# Altium project PCB_SmartHome.PrjPcb
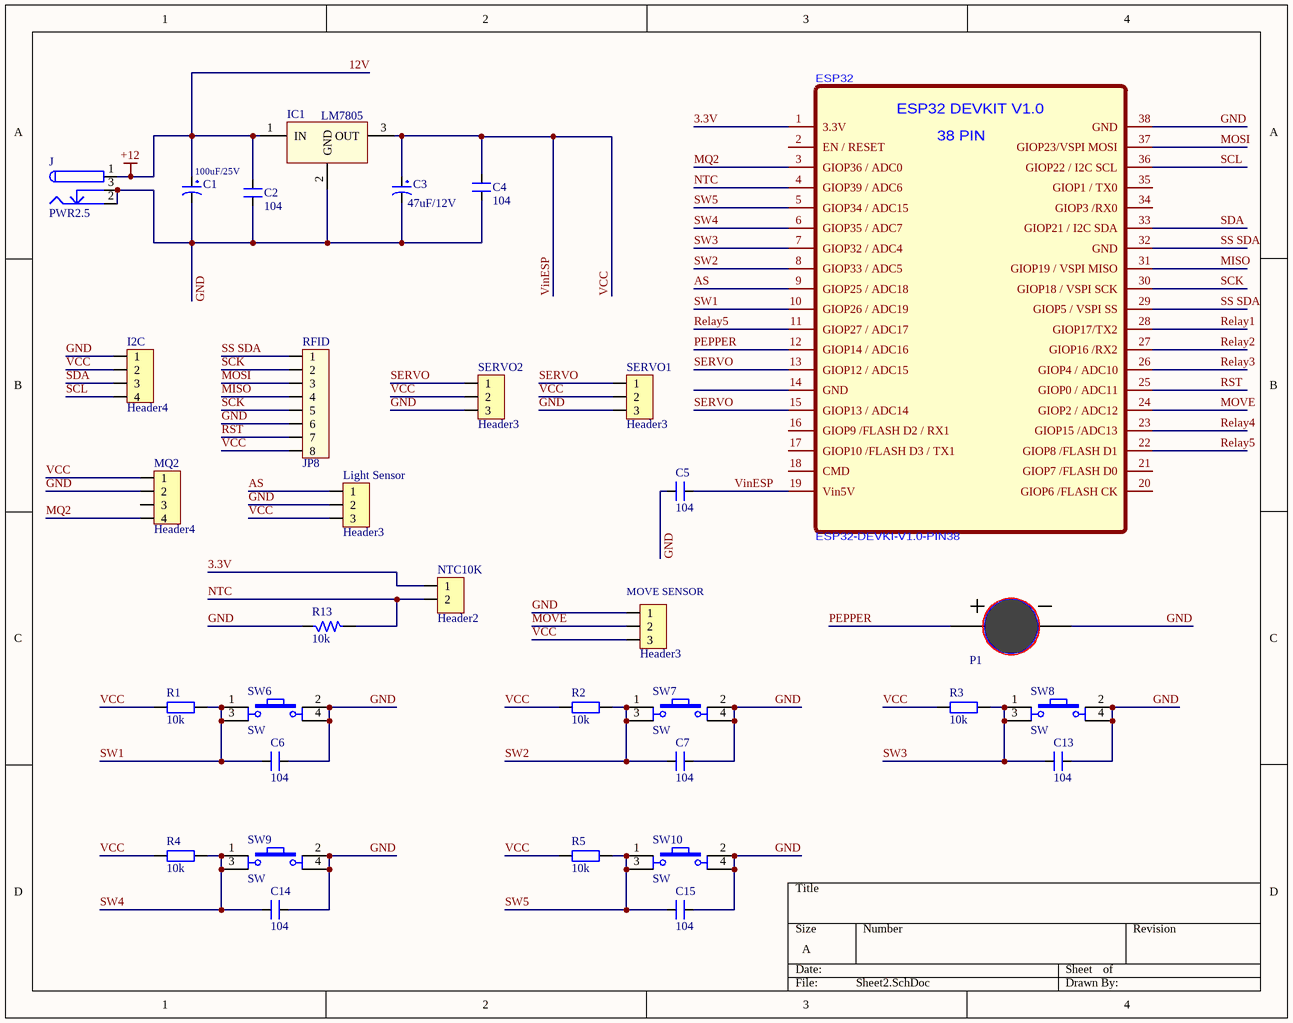
[diagram p0: Sheet2.SchDoc]
2 sheets, 48 parts. Net scope: global (net labels, ports and power ports of the same name join across sheets).
Board file: PCB2.PcbDoc
Sheets:
  Sheet2.SchDoc
  Khoi_Switch.SchDoc

## Sheet Sheet2.SchDoc
size A; SheetNumber: 1; SheetTotal: 2

### Parts
?  P1  [PCBComponent_1]
C1  100uF/25V  [CP1.5/3.4]
C2  104  [CN2]
C3  47uF/12V  [CP1.5/3.4]
C4  104  [CN2]
C5  104  [CN2]
C6  104  [CN2]
C7  104  [CN2]
C13  104  [CN2]
C14  104  [CN2]
C15  104  [CN2]
ESP32  ESP32-DEVKI-V1.0-PIN38  [ESP32-DEVKIT-V1.0-38PIN-PCB - duplicate]
I2C  Header4  [HDR4]
IC1  LM7805  [QTO-220]
J  PWR2.5  [PW-J-2MM]
Light_Sensor  Header3  [HDR3]
MOVE_SENSOR  Header3  [HDR3]
MQ2  Header4  [HDR4]
NTC10K  Header2  [HDR2]
R1  10k  [R1/4W]
R2  10k  [R1/4W]
R3  10k  [R1/4W]
R4  10k  [R1/4W]
R5  10k  [R1/4W]
R13  10k  [R1/8W]
RFID  JP8  [Header8]
SERVO1  Header3  [HDR3]
SERVO2  Header3  [HDR3]
SW6  SW  [SW4]
SW7  SW  [SW4]
SW8  SW  [SW4]
SW9  SW  [SW4]
SW10  SW  [SW4]

### Nets
12V: C1.1 C2.2 IC1.1(IN) J.1  [also labelled +12]
3.3V: ESP32.1(3.3V) NTC10K.1
AS: ESP32.9(GIOP25_/_ADC18) Light_Sensor.1
GND: ?.2 C1.2 C2.1 C3.2 C4.1 C5.1 C6.2 C7.2 C13.2 C14.2 C15.2 ESP32.38(GND) I2C.1 IC1.2(GND) J.2 J.3 Light_Sensor.2 MOVE_SENSOR.1 MQ2.2 R13.1 RFID.6 SERVO1.3 SERVO2.3 SW6.2 SW6.4 SW7.2 SW7.4 SW8.2 SW8.4 SW9.2 SW9.4 SW10.2 SW10.4
MISO: ESP32.31(GIOP19_/_VSPI_MISO) RFID.4
MOSI: ESP32.37(GIOP23/VSPI_MOSI) RFID.3
MOVE: ESP32.24(GIOP2_/_ADC12) MOVE_SENSOR.2
MQ2: ESP32.3(GIOP36_/_ADC0) MQ2.4
NTC: ESP32.4(GIOP39_/_ADC6) NTC10K.2 R13.2
PEPPER: ?.1 ESP32.12(GIOP14_/_ADC16)
Relay1: ESP32.28(GIOP17/TX2)
Relay2: ESP32.27(GIOP16_/RX2)
Relay3: ESP32.26(GIOP4_/_ADC10)
Relay4: ESP32.23(GIOP15_/ADC13)
Relay5: ESP32.11(GIOP27_/_ADC17) ESP32.22(GIOP8_/FLASH_D1)
RST: ESP32.25(GIOP0_/_ADC11) RFID.7
SCK: ESP32.30(GIOP18_/_VSPI_SCK) RFID.2 RFID.5
SCL: ESP32.36(GIOP22_/_I2C_SCL) I2C.4
SDA: ESP32.33(GIOP21_/_I2C_SDA) I2C.3
SERVO: ESP32.13(GIOP12_/_ADC15) ESP32.15(GIOP13_/_ADC14) SERVO1.1 SERVO2.1
SS SDA: ESP32.29(GIOP5_/_VSPI_SS) ESP32.32(GND) RFID.1
SW1: C6.1 ESP32.10(GIOP26_/_ADC19) R1.2 SW6.1 SW6.3
SW2: C7.1 ESP32.8(GIOP33_/_ADC5) R2.2 SW7.1 SW7.3
SW3: C13.1 ESP32.7(GIOP32_/_ADC4) R3.2 SW8.1 SW8.3
SW4: C14.1 ESP32.6(GIOP35_/_ADC7) R4.2 SW9.1 SW9.3
SW5: C15.1 ESP32.5(GIOP34_/_ADC15) R5.2 SW10.1 SW10.3
VCC: C3.1 C4.2 C5.2 ESP32.19(Vin5V) I2C.2 IC1.3(OUT) Light_Sensor.3 MOVE_SENSOR.3 MQ2.1 R1.1 R2.1 R3.1 R4.1 R5.1 RFID.8 SERVO1.2 SERVO2.2  [also labelled VinESP]

Not connected (* = marked no-connect by the designer): ESP32 2(EN_/_RESET) 14(GND) 16(GIOP9_/FLASH_D2_/_RX1) 17(GIOP10_/FLASH_D3_/_TX1) 18(CMD) 20(GIOP6_/FLASH_CK) 21(GIOP7_/FLASH_D0) 34(GIOP3_/RX0) 35(GIOP1_/_TX0); MQ2 3

### Notes on the sheet
- (in symbol ESP32-DEVKI-V1.0-PIN38) ESP32 DEVKIT V1.0; 38 PIN

### Library data of the parts
? = Pepper: Pepper 5V
C1 C3 = CP3: Cap 100uF/35V - 470uF/16V; Value: 100uF/35V/50V; Description 1: 1000uF/6,3V - 470uF/16V - 330uF - 25V; Description 2: 220uF/35V - 100uF/50V - 63V - 4,7uF/200V; Description 3: 22uF => 33uF100V - 3,3uF => 4,7uF/250V; Description 4: 2,2uF =>3,3uF/350 - 2,2uF/400V - 1uF/450V
C2 C4-C7 C13-C15 = CN2: Cap np 104 => 105pF; Value: 0.1uF
I2C MQ2 = Header4: Header IDC, 4 x 1 Pin Vertical 2.54mm Pitch (Non-Boxed, Male); Manufacturer: W¨¹rth Elektronik eiSos GmbH; partNo: 613002143121; ComponentLink1 Description: Manufacturer; ComponentLink2 Description: Datasheet; NoPins: 02; Created Date: 29 March 2013; ComponentLink1URL: http://www.we-online.com; ComponentLink2URL: http://katalog.we-online.de/em/datasheet/6130xx143121.pdf; Created by: Karrer Zheng
IC1 = LM78xx: On ap +, from + 5 to + 24VDC; Value: LM7805
J = PWR2.5: Low Voltage Power Supply Connector; Published: 17-Dec-2003; DatasheetDocument: 09-May-2002; Publisher: Altium Limited; ComponentLink1Description: Manufacturer Link; ComponentLink1URL: http://domino.kycon.com/internet/Products.html
Light_Sensor MOVE_SENSOR SERVO1 SERVO2 = Header3: Header IDC, 3 x 1 Pin Vertical 2.54mm Pitch (Non-Boxed, Male); Manufacturer: W¨¹rth Elektronik eiSos GmbH; partNo: 613002143121; ComponentLink1 Description: Manufacturer; ComponentLink2 Description: Datasheet; NoPins: 02; Created Date: 29 March 2013; ComponentLink1URL: http://www.we-online.com; ComponentLink2URL: http://katalog.we-online.de/em/datasheet/6130xx143121.pdf; Created by: Karrer Zheng
NTC10K = Header2: Header IDC, 2 x 1 Pin Vertical 2.54mm Pitch (Non-Boxed, Male); Manufacturer: W¨¹rth Elektronik eiSos GmbH; partNo: 613002143121; ComponentLink1 Description: Manufacturer; ComponentLink2 Description: Datasheet; NoPins: 02; Created Date: 29 March 2013; ComponentLink1URL: http://www.we-online.com; ComponentLink2URL: http://katalog.we-online.de/em/datasheet/6130xx143121.pdf; Created by: Karrer Zheng
R1-R5 = R1/4W: Resistor 1/4W; Value: R1/4W - 1K
R13 = R: Resistor 1/4W; Value: R1/4W - 1K
RFID = Header8: Connector 8; Value: Connector 8
SW6-SW10 = SW4: Switch button 4 pin; Value: Button chip 4 pin

## Sheet Khoi_Switch.SchDoc
size A; SheetNumber: 3; SheetTotal: 3
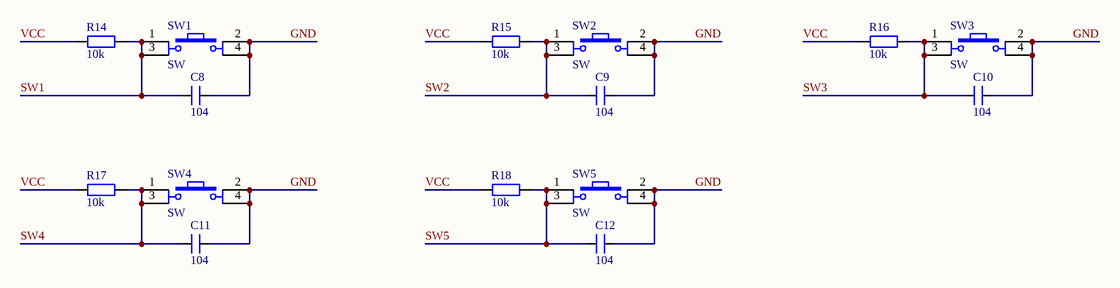
[diagram p1: Khoi_Switch.SchDoc]

### Parts
C8  104  [CN2]
C9  104  [CN2]
C10  104  [CN2]
C11  104  [CN2]
C12  104  [CN2]
R14  10k  [R1/4W]
R15  10k  [R1/4W]
R16  10k  [R1/4W]
R17  10k  [R1/4W]
R18  10k  [R1/4W]
SW1  SW  [SW4]
SW2  SW  [SW4]
SW3  SW  [SW4]
SW4  SW  [SW4]
SW5  SW  [SW4]

### Nets
GND: C8.2 C9.2 C10.2 C11.2 C12.2 SW1.2 SW1.4 SW2.2 SW2.4 SW3.2 SW3.4 SW4.2 SW4.4 SW5.2 SW5.4
SW1: C8.1 R14.2 SW1.1 SW1.3
SW2: C9.1 R15.2 SW2.1 SW2.3
SW3: C10.1 R16.2 SW3.1 SW3.3
SW4: C11.1 R17.2 SW4.1 SW4.3
SW5: C12.1 R18.2 SW5.1 SW5.3
VCC: R14.1 R15.1 R16.1 R17.1 R18.1

### Library data of the parts
C8-C12 = CN2: Cap np 104 => 105pF; Value: 0.1uF
R14-R18 = R1/4W: Resistor 1/4W; Value: R1/4W - 1K
SW1-SW5 = SW4: as SW6 on sheet Sheet2

## Nets that join several sheets
GND: Sheet2 (33 pins), Khoi_Switch (15 pins)
SW1: Sheet2 (5 pins), Khoi_Switch (C8.1 R14.2 SW1.1 SW1.3)
SW2: Sheet2 (5 pins), Khoi_Switch (C9.1 R15.2 SW2.1 SW2.3)
SW3: Sheet2 (5 pins), Khoi_Switch (C10.1 R16.2 SW3.1 SW3.3)
SW4: Sheet2 (5 pins), Khoi_Switch (C11.1 R17.2 SW4.1 SW4.3)
SW5: Sheet2 (5 pins), Khoi_Switch (C12.1 R18.2 SW5.1 SW5.3)
VCC: Sheet2 (17 pins), Khoi_Switch (5 pins)